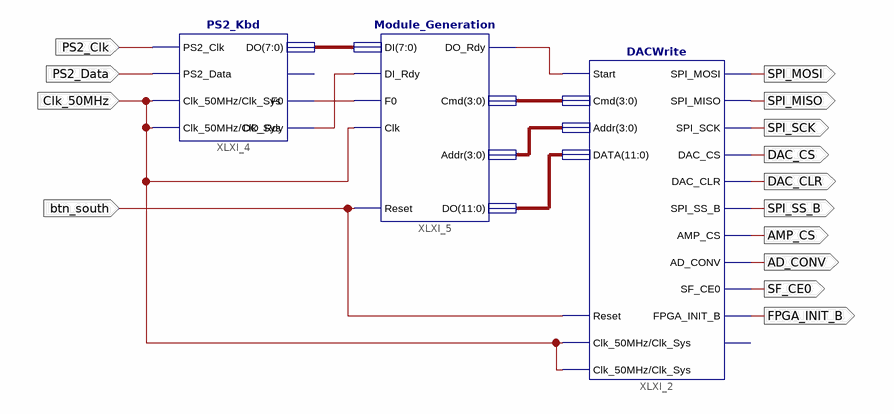
[diagram p0: schematic sheet 1]
// Xilinx ISE schematic TopProject.sch (spartan3e) as structural Verilog: 3 symbols, 14 ports
module TopProject (
  input  Clk_50MHz,
  input  PS2_Clk,
  input  PS2_Data,
  input  btn_south,
  output SPI_MOSI,
  output SPI_MISO,
  output SPI_SCK,
  output DAC_CS,
  output DAC_CLR,
  output SPI_SS_B,
  output AMP_CS,
  output AD_CONV,
  output SF_CE0,
  output FPGA_INIT_B
);

  wire XLXN_50, XLXN_51, XLXN_52;
  wire [3:0] XLXN_6, XLXN_7;
  wire [7:0] XLXN_49;
  wire [11:0] XLXN_55;

  DACWrite XLXI_2 (
    .Reset(btn_south), .Start(XLXN_52), .SPI_MISO(SPI_MISO), .Cmd(XLXN_7), .Addr(XLXN_6), .DATA(XLXN_55),
    .DAC_CLR(DAC_CLR), .DAC_CS(DAC_CS), .SPI_MOSI(SPI_MOSI), .SPI_SCK(SPI_SCK), .SPI_SS_B(SPI_SS_B),
    .AMP_CS(AMP_CS), .AD_CONV(AD_CONV), .SF_CE0(SF_CE0), .FPGA_INIT_B(FPGA_INIT_B), .Clk_50MHz(Clk_50MHz),
    .Clk_Sys(Clk_50MHz));  // open: Busy
  PS2_Kbd XLXI_4 (
    .PS2_Clk(PS2_Clk), .PS2_Data(PS2_Data), .Clk_50MHz(Clk_50MHz), .F0(XLXN_50), .DO_Rdy(XLXN_51),
    .DO(XLXN_49), .Clk_Sys(Clk_50MHz));  // open: E0
  Module_Generation XLXI_5 (
    .DI(XLXN_49), .DI_Rdy(XLXN_51), .F0(XLXN_50), .Clk(Clk_50MHz), .Reset(btn_south), .DO_Rdy(XLXN_52),
    .Cmd(XLXN_7), .Addr(XLXN_6), .DO(XLXN_55));
endmodule
